# EasyEDA Pro project XWQ_Board1.eprj

# Schematic Schematic1
Create Date: 2023-08-19; Page Name: P1; Project Name: XWQ_Board1; Schematic Name: Schematic1; Update Date: 2023-08-19; Company: 嘉立创EDA; Page Size: A4; Version: V1.0
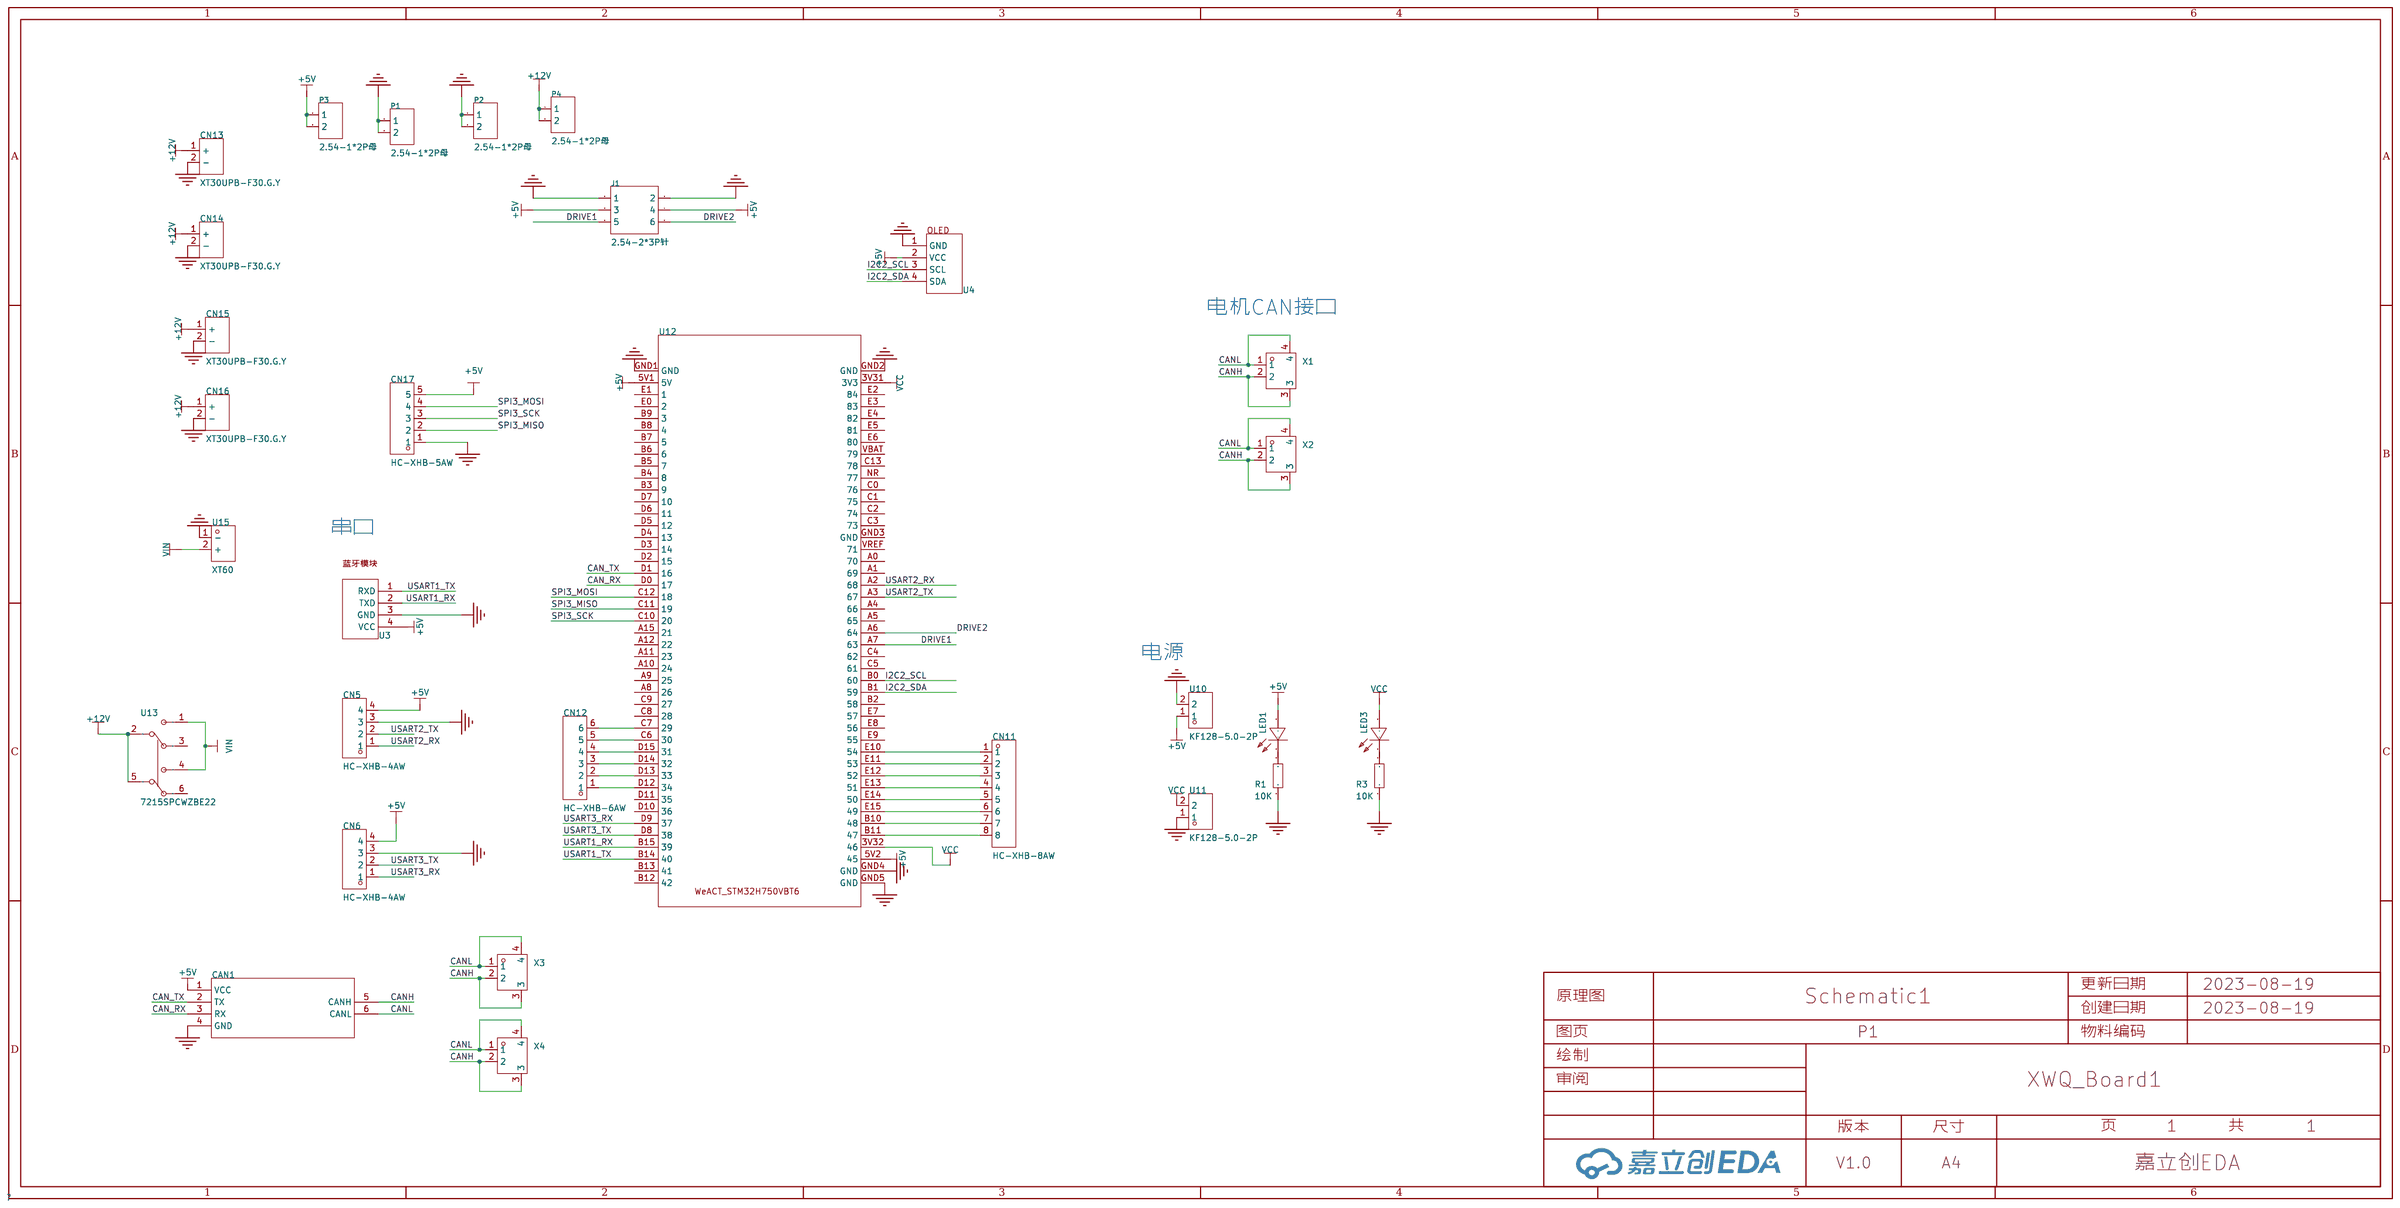
[diagram p0: schematic sheet]

## Parts
CAN1  -  [CAN模块]
CN5  HC-XHB-4AW  [CONN-TH_4P-P2.5_HCTL_HC-XHB-4AW]
CN6  HC-XHB-4AW  [CONN-TH_4P-P2.5_HCTL_HC-XHB-4AW]
CN11  HC-XHB-8AW  [CONN-TH_HC-XHB-8AW]
CN12  HC-XHB-6AW  [CONN-TH_6P-P2.50_HCTL_HC-XHB-6AW]
CN13  XT30UPB-F30.G.Y  [CONN-TH_XT30UPB-F]
CN14  XT30UPB-F30.G.Y  [CONN-TH_XT30UPB-F]
CN15  XT30UPB-F30.G.Y  [CONN-TH_XT30UPB-F]
CN16  XT30UPB-F30.G.Y  [CONN-TH_XT30UPB-F]
CN17  HC-XHB-5AW  [CONN-TH_5P-P2.50_HCTL_HC-XHB-5AW]
J1  2.54-2*3P针  [HDR-TH_6P-P2.54-V-M-R2-C3-S2.54-1]
LED1  NCD0805R1  [LED0805-RD_RED]
LED3  NCD0805R1  [LED0805-RD_RED]
P1  2.54-1*2P母  [HDR-TH_2P-P2.54-V-F]
P2  2.54-1*2P母  [HDR-TH_2P-P2.54-V-F]
P3  2.54-1*2P母  [HDR-TH_2P-P2.54-V-F]
P4  2.54-1*2P母  [HDR-TH_2P-P2.54-V-F]
R1  10K  [R0603]
R3  10K  [R0603]
U3  -  [蓝牙模块]
U4  -  [OLED]
U10  KF128-5.0-2P  [CONN-TH_P5.00_KF128-5.0-2P]
U11  KF128-5.0-2P  [CONN-TH_P5.00_KF128-5.0-2P]
U12  -  [WeAct_STM32H750VBT6核心板]
U13  7215SPCWZBE22  [SW-TH_6P-L12.7-W11.4-P4.70-LS4.8]
U15  XT60  [CONN-TH_XT60]
X1  GH125-S02DCA-00  [CONN-SMD_2P-P1.25_JUSHUO_GH125-S02DCA-00]
X2  GH125-S02DCA-00  [CONN-SMD_2P-P1.25_JUSHUO_GH125-S02DCA-00]
X3  GH125-S02DCA-00  [CONN-SMD_2P-P1.25_JUSHUO_GH125-S02DCA-00]
X4  GH125-S02DCA-00  [CONN-SMD_2P-P1.25_JUSHUO_GH125-S02DCA-00]

## Library data of the parts
CAN1 = CAN模块
CN5 CN6 = HC-XHB-4AW: 参考系列:-;间距:2.5mm;插针结构:1x4P;排数:1;每排PIN数:4;行距:-;公母:公型插针;安装方式:弯插;额定电流:3A;工作温度范围:-25℃~+85℃;; LCSC Part Name: 2.54带锁扣卧式插件 4P 针座连接器线对板/线对线连接器; Supplier Part: C2845507; Manufacturer: HCTL(华灿天禄); Supplier Footprint: 弯插,P=2.5mm; JLCPCB Part Class: Extended Part; Datasheet: https://atta.szlcsc.com/upload/public/pdf/source/20210729/C2845505_EFBF7AEAA36C6A5A1E79F7933436620E.pdf; Supplier: LCSC; Pitch: 2.5mm; Pins Structure: 1x4P; Number of Rows: 1; Number of PINs Per Row: 4; Gender: 公型插针; Mounting Style: 弯插; Current Rating (Max): 3A; Operating Temperature Range: -25℃~+85℃
CN11 = HC-XHB-8AW: 参考系列:-;间距:2.5mm;插针结构:1x8P;排数:1;每排PIN数:8;行距:-;公母:公型插针;安装方式:弯插;额定电流:3A;工作温度范围:-25℃~+85℃;; LCSC Part Name: 2.54带锁扣卧式插件 8P 针座连接器线对板/线对线连接器; Supplier Part: C2845511; Manufacturer: HCTL(华灿天禄); Supplier Footprint: 弯插,P=2.5mm; JLCPCB Part Class: Extended Part; Datasheet: https://atta.szlcsc.com/upload/public/pdf/source/20210729/C2845505_EFBF7AEAA36C6A5A1E79F7933436620E.pdf; Supplier: LCSC; Pitch: 2.5mm; Pins Structure: 1x8P; Number of Rows: 1; Number of PINs Per Row: 8; Gender: 公型插针; Mounting Style: 弯插; Current Rating (Max): 3A; Operating Temperature Range: -25℃~+85℃
CN12 = HC-XHB-6AW: 参考系列:-;间距:2.5mm;插针结构:1x6P;排数:1;每排PIN数:6;行距:-;公母:公型插针;安装方式:弯插;额定电流:3A;工作温度范围:-25℃~+85℃;; LCSC Part Name: 2.54带锁扣卧式插件 6P 针座连接器线对板/线对线连接器; Supplier Part: C2845509; Manufacturer: HCTL(华灿天禄); Supplier Footprint: 弯插,P=2.5mm; JLCPCB Part Class: Extended Part; Datasheet: https://atta.szlcsc.com/upload/public/pdf/source/20210729/C2845505_EFBF7AEAA36C6A5A1E79F7933436620E.pdf; Supplier: LCSC; Pitch: 2.5mm; Pins Structure: 1x6P; Number of Rows: 1; Number of PINs Per Row: 6; Gender: 公型插针; Mounting Style: 弯插; Current Rating (Max): 3A; Operating Temperature Range: -25℃~+85℃
CN13-CN16 = XT30UPB-F30.G.Y: 模型插头连接器; LCSC Part Name: AMASS(艾迈斯)直立焊板式连接器XT30UPB30-F.G.*; Supplier Part: C108769; Manufacturer: AMASS(艾迈斯); JLCPCB Part Class: 扩展库; Datasheet: https://atta.szlcsc.com/upload/public/pdf/source/20220715/AFD68B9E8B6CA95A7295DBF4AF9325E4.pdf; Supplier: LCSC
CN17 = HC-XHB-5AW: 参考系列:-;间距:2.5mm;插针结构:1x5P;排数:1;每排PIN数:5;行距:-;公母:公型插针;安装方式:弯插;额定电流:3A;工作温度范围:-25℃~+85℃;; LCSC Part Name: 2.54带锁扣卧式插件 5P 针座连接器线对板/线对线连接器; Supplier Part: C2845508; Manufacturer: HCTL(华灿天禄); Supplier Footprint: 弯插,P=2.5mm; JLCPCB Part Class: 扩展库; Datasheet: https://atta.szlcsc.com/upload/public/pdf/source/20210729/C2845505_EFBF7AEAA36C6A5A1E79F7933436620E.pdf; Supplier: LCSC; Pitch: 2.5mm; Pins Structure: 1x5P; Number of Rows: 1; Number of PINs Per Row: 5; Gender: 公型插针; Mounting Style: 弯插; Current Rating (Max): 3A; Operating Temperature Range: -25℃~+85℃
J1 = 2.54-2*3P针: 排数:双排;总PIN位数:6P;间距:2.54mm;插针结构:-;行距:-;安装类型:直插;圆针/方针:-;额定电流:-;额定电压:-;配合针长度:-;塑高:-;触头材质:-;触头镀层:-;颜色:黑色;; LCSC Part Name: 2.54mm 直插; Supplier Part: C65114; Manufacturer: BOOMELE(博穆精密); Supplier Footprint: 插件,P=2.54mm; JLCPCB Part Class: 扩展库; Supplier: LCSC; Number of Rows: 双排; Number of Pins: 6P; Pitch: 2.54mm; Mounting Type: 直插; Color: 黑色
LED1 LED3 = NCD0805R1: 发光颜色:红灯;; LCSC Part Name: 红灯; Supplier Part: C84256; Manufacturer: 国星光电; Supplier Footprint: 0805; JLCPCB Part Class: Basic Part; Datasheet: https://atta.szlcsc.com/upload/public/pdf/source/20200820/C84256_F0A75A43B3EAD75808600A0514C76B99.pdf; Supplier: LCSC; Emitted Color: 红灯
P1-P4 = 2.54-1*2P母: 排数:单排;总孔位数:2;间距:2.54mm;插孔结构:1x2P;行距:-;安装类型:直插;塑高:-;触头材质:-;触头镀层:-;; LCSC Part Name: 2.54mm 1x2P; Supplier Part: C49661; Manufacturer: BOOMELE(博穆精密); Supplier Footprint: 直插,P=2.54mm; JLCPCB Part Class: 扩展库; Supplier: LCSC; Number of Rows: 单排; Number of Holes: 2; Pitch: 2.54mm; Holes Structure: 1x2P; Mounting Type: 直插
R1 R3 = Res_0603: Supplier Footprint: 0603
U3 = 蓝牙模块
U4 = OLED
U10 U11 = KF128-5.0-2P: 间距:5mm;排数:1;每排PIN数:2;安装方式:直针;额定电流:24A;额定电压:250V;线规 - AWG:12~22;线规 - mm?:2.5;工作温度范围:-40℃~+105℃;颜色:绿色;; LCSC Part Name: 5mm 排数:1 每排P数:2 直针 可拼接 铜 环保; Supplier Part: C474950; Manufacturer: KEFA(科发); Supplier Footprint: 直插,P=5mm; JLCPCB Part Class: Extended Part; Datasheet: https://atta.szlcsc.com/upload/public/pdf/source/20200115/C474950_DBD958BD409DEFD076718528A2A5023E.pdf; Supplier: LCSC; Pitch: 5mm; Number of Rows: 1; Number of PINs Per Row: 2; Mounting Style: 直针; Current Rating (Max): 24A; Voltage Rating (Max): 250V; Wire Gauge - AWG: 12~22; Wire Gauge - mm?: 2.5; Operating Temperature Range: -40℃~+105℃; Color: 绿色
U12 = STM32H750VBT6
U13 = 7215SPCWZBE22: LCSC Part Name: 钮子开关; Supplier Part: C2895583; Manufacturer: CK; Supplier Footprint: 插件; JLCPCB Part Class: 扩展库; Datasheet: https://atta.szlcsc.com/upload/public/pdf/source/20211231/11C8489155551633DA4BD4318A5AC87F.pdf; Supplier: LCSC
U15 = XT60: 模型锂电连接器 XT60-M; LCSC Part Name: AMASS(艾迈斯) XT60模型插头 3.5mm镀金香蕉头公头（电调端）XT60-M; Supplier Part: C98733; Manufacturer: AMASS(艾迈斯); JLCPCB Part Class: 扩展库; Datasheet: https://atta.szlcsc.com/upload/public/pdf/source/20170606/1496716524919.pdf; Supplier: LCSC
X1-X4 = GH125-S02DCA-00: 参考系列:-;间距:1.25mm;插针结构:1x2P;排数:1;每排PIN数:2;行距:-;公母:公型插针;安装方式:卧贴;额定电流:1A;工作温度范围:-25℃~+85℃;; LCSC Part Name: GH1.25卧式贴片 带扣; Supplier Part: C2886765; Manufacturer: JS(钜硕电子); Supplier Footprint: SMD,P=1.25mm; JLCPCB Part Class: Extended Part; Datasheet: https://atta.szlcsc.com/upload/public/pdf/source/20210818/CD11791E5ED3EDF45A7009E9C8A2BD4C.pdf; Supplier: LCSC; Pitch: 1.25mm; Pins Structure: 1x2P; Number of Rows: 1; Number of PINs Per Row: 2; Gender: 公型插针; Mounting Style: 卧贴; Current Rating (Max): 1A; Operating Temperature Range: -25℃~+85℃

## Nets
+5V: CAN1.1(VCC) CN5.4 CN6.4 CN17.5 J1.3 J1.4 LED1.2(+) P3.1 P3.2 U3.4(VCC) U4.2(VCC) U10.1 U12.5V1(5V) U12.5V2(45)
+12V: CN13.1(+) CN14.1(+) CN15.1(+) CN16.1(+) P4.1 P4.2 U13.2 U13.5
GND: CAN1.4(GND) CN5.3 CN6.3 CN13.2(-) CN14.2(-) CN15.2(-) CN16.2(-) CN17.1 J1.1 J1.2 P1.1 P1.2 P2.1 P2.2 R1.1 R3.1 U3.3(GND) U4.1(GND) U10.2 U11.1 U12.GND1(GND) U12.GND2(GND) U12.GND4(GND) U12.GND5(GND) U15.1(-)
VCC: LED3.2(+) U11.2 U12.3V31(3V3) U12.3V32(46)
VIN: U13.1 U13.4 U15.2(+)
CAN_RX: CAN1.3(RX) U12.D0(17)
CAN_TX: CAN1.2(TX) U12.D1(16)
CANH: CAN1.5(CANH) X1.2 X1.3 X2.2 X2.3 X3.2 X3.3 X4.2 X4.3
CANL: CAN1.6(CANL) X1.1 X1.4 X2.1 X2.4 X3.1 X3.4 X4.1 X4.4
DRIVE1: J1.5 U12.A7(63)
DRIVE2: J1.6 U12.A6(64)
I2C2_SCL: U4.3(SCL) U12.B0(60)
I2C2_SDA: U4.4(SDA) U12.B1(59)
SPI3_MISO: CN17.2 U12.C11(19)
SPI3_MOSI: CN17.4 U12.C12(18)
SPI3_SCK: CN17.3 U12.C10(20)
USART1_RX: U3.2(TXD) U12.B15(39)
USART1_TX: U3.1(RXD) U12.B14(40)
USART2_RX: CN5.1 U12.A2(68)
USART2_TX: CN5.2 U12.A3(67)
USART3_RX: CN6.1 U12.D9(37)
USART3_TX: CN6.2 U12.D8(38)
$1N11723: LED1.1(-) R1.2
$1N25769: LED3.1(-) R3.2
$1N27531: CN11.7 U12.B10(48)
$1N27535: CN11.6 U12.E15(49)
$1N27540: CN11.5 U12.E14(50)
$1N27544: CN11.4 U12.E13(51)
$1N27548: CN11.3 U12.E12(52)
$1N27552: CN11.2 U12.E11(53)
$1N27556: CN11.1 U12.E10(54)
$1N30172: CN12.1 U12.D12(34)
$1N30176: CN12.2 U12.D13(33)
$1N30180: CN12.3 U12.D14(32)
$1N30184: CN12.4 U12.D15(31)
$1N30188: CN12.5 U12.C6(30)
$1N30192: CN12.6 U12.C7(29)
$1N35901: CN11.8 U12.B11(47)

Not connected (* = marked no-connect by the designer): U12 A0(70) A1(69) A4(66) A5(65) A8(26) A9(25) A10(24) A11(23) A12(22) A15(21) B2(58) B3(9) B4(8) B5(7) B6(6) B7(5) B8(4) B9(3) B12(42) B13(41) C0(76) C1(75) C2(74) C3(73) C4(62) C5(61) C8(28) C9(27) C13(78) D2(15) D3(14) D4(13) D5(12) D6(11) D7(10) D10(36) D11(35) E0(2) E1(1) E2(84) E3(83) E4(82) E5(81) E6(80) E7(57) E8(56) E9(55) GND3(GND) NR(77) VBAT(79) VREF(71); U13 3 6

## Notes on the sheet
- 电机CAN接口
- 串口
- 电源

# Board PCB3
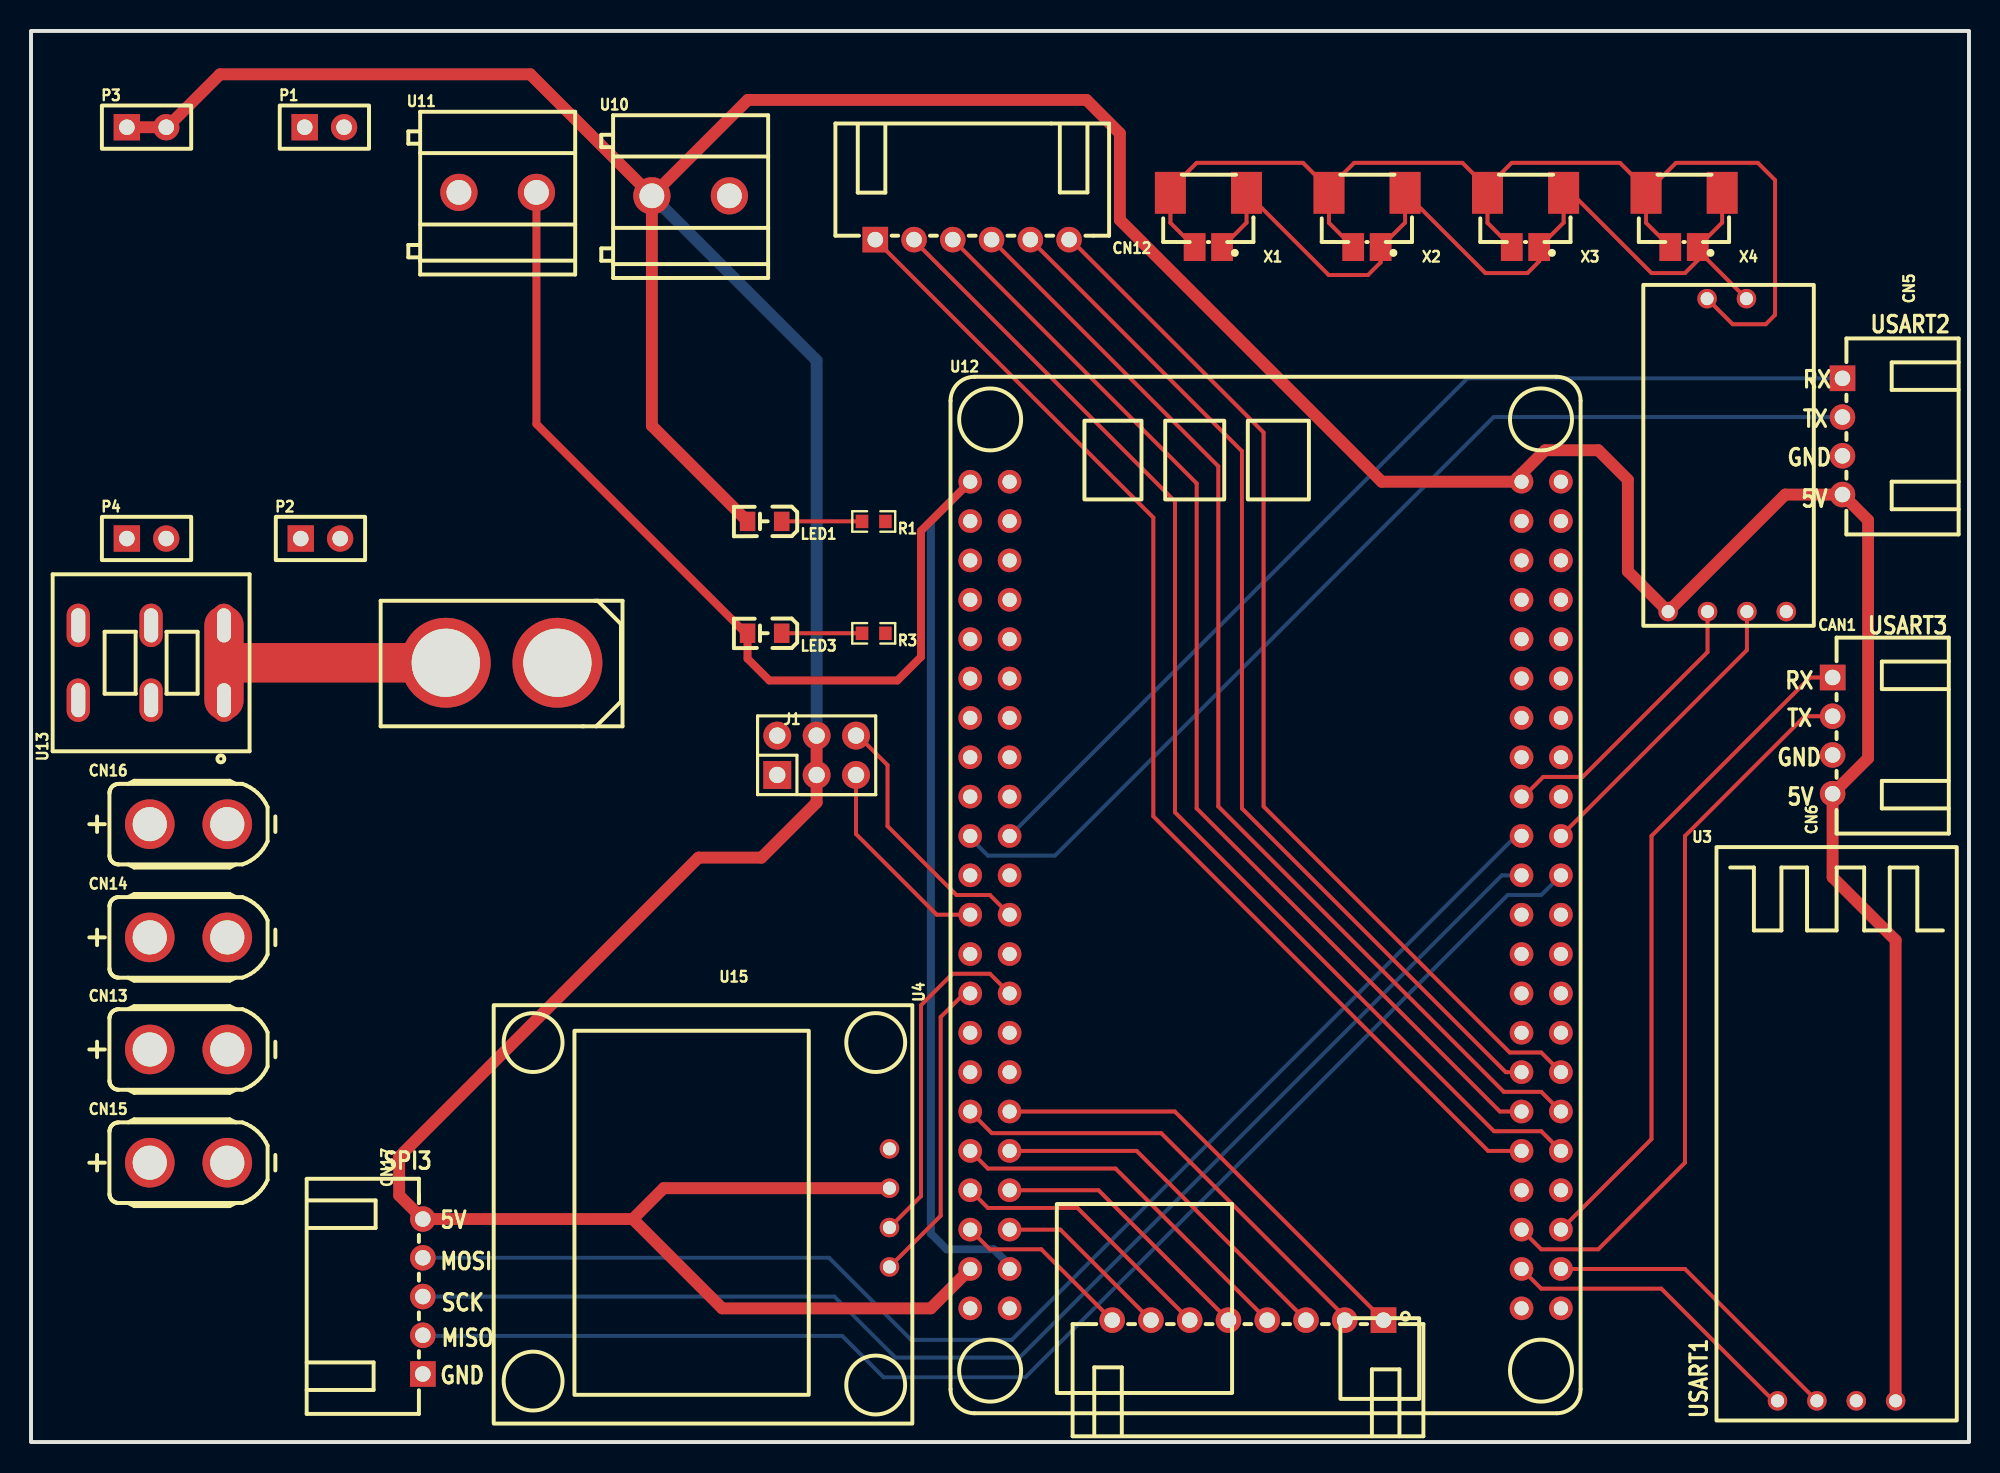
[diagram p1: board, top side]
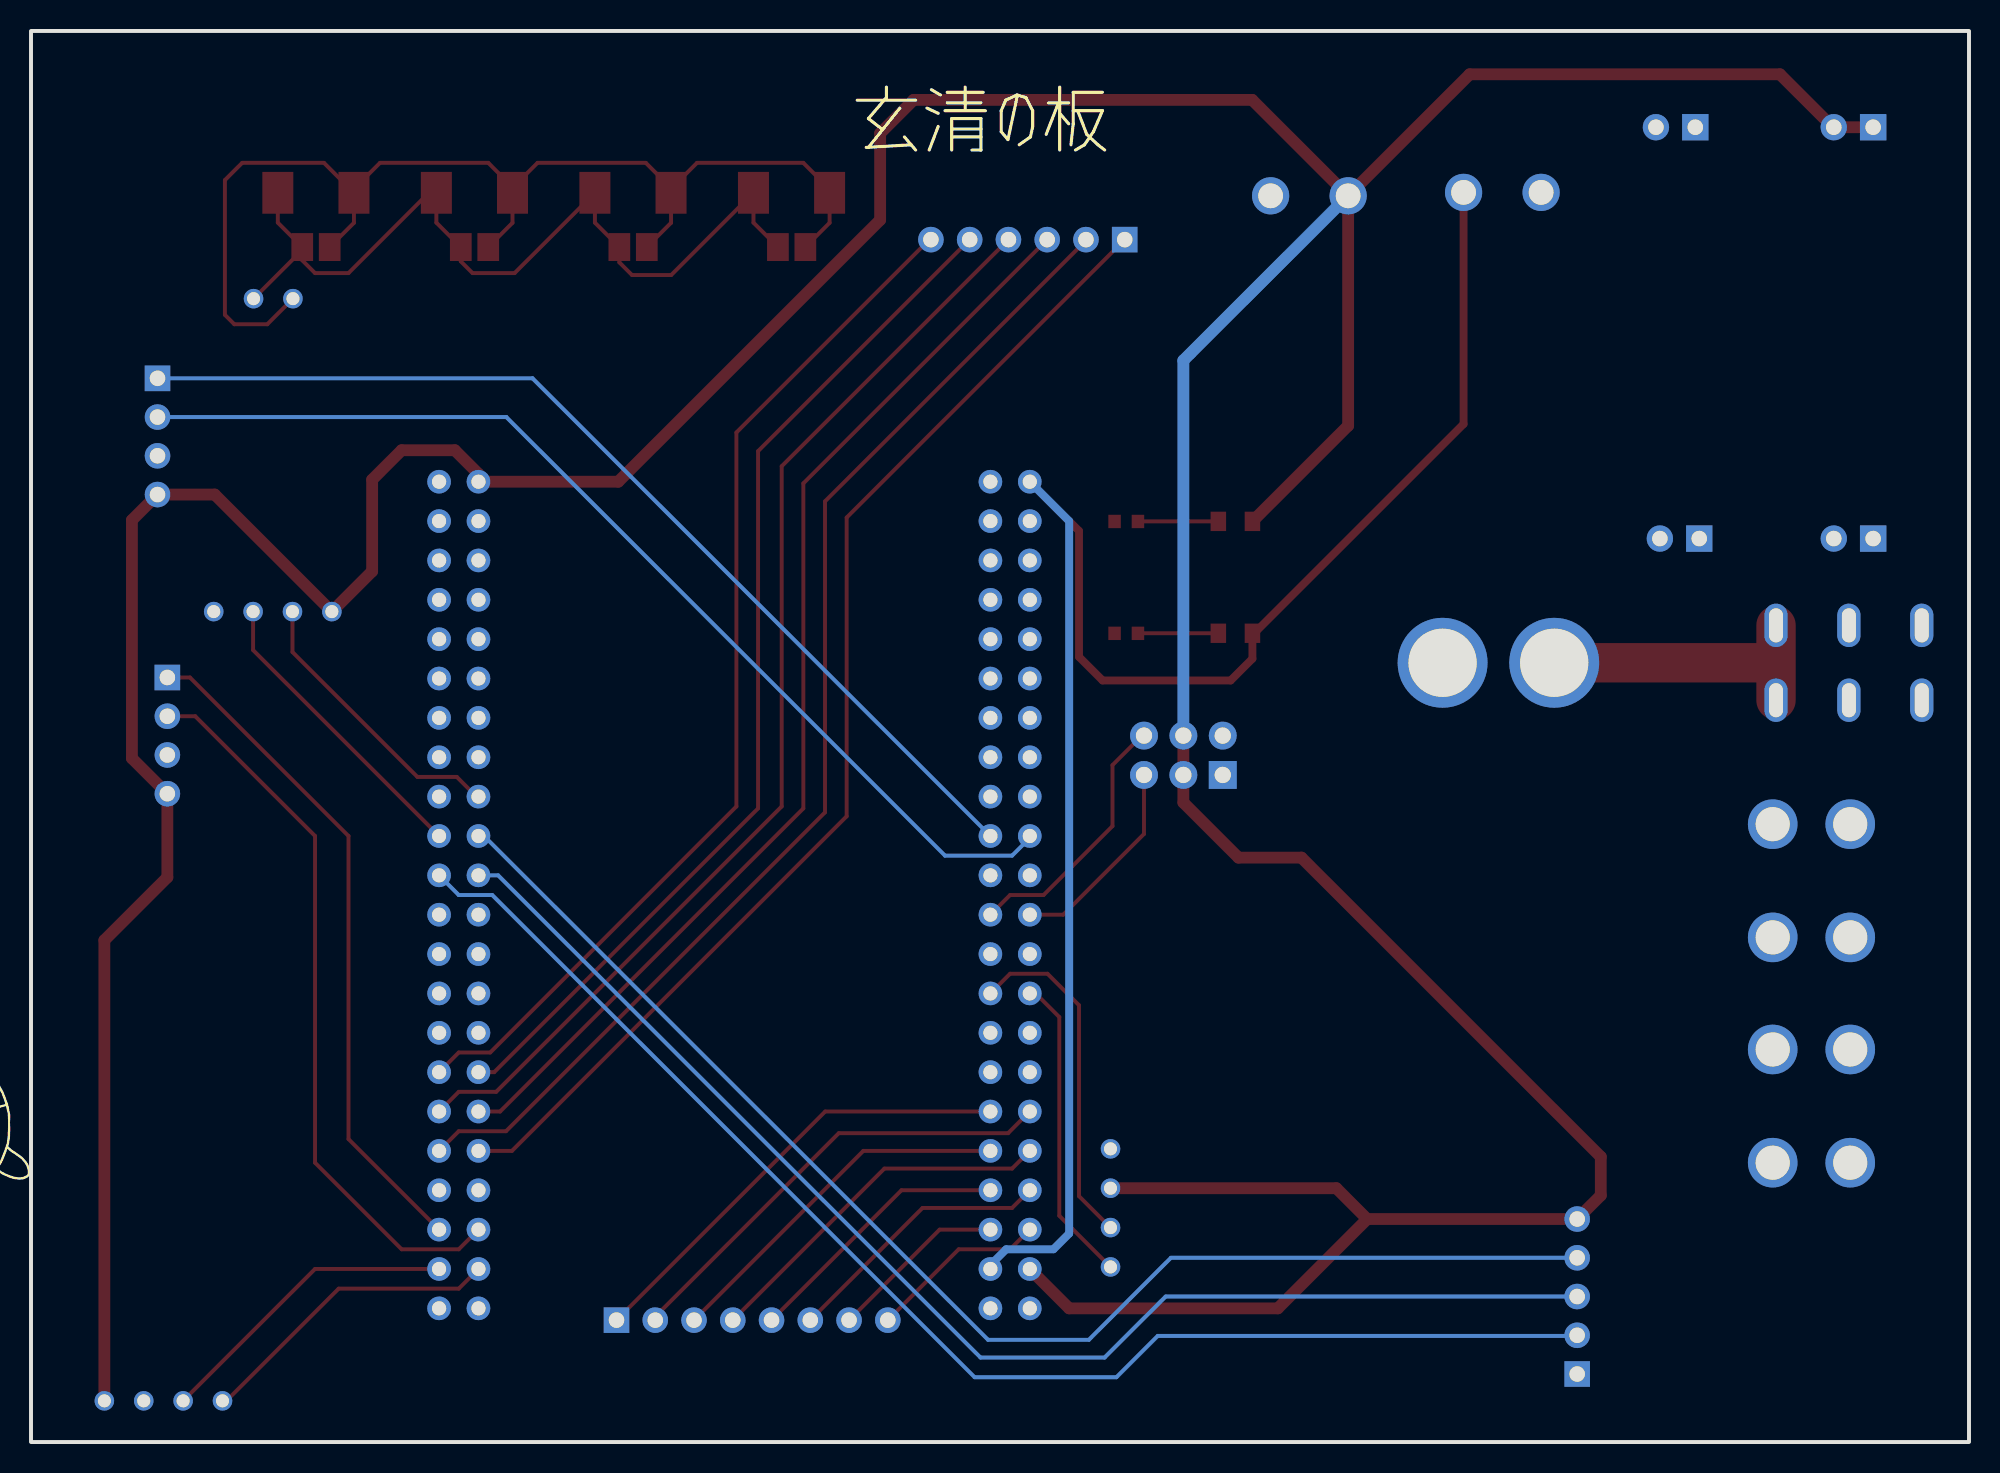
[diagram p2: board, bottom side, seen from below]

Outline 125 x 91.05 mm; copper layers: Top Layer, Bottom Layer. Coordinates in mm from the lower left corner of the outline.
Outline path: rectangle 0,91.05 125,0
Stack: Top Layer 0.035mm / Dielectric1 1.51mm FR4 er 4.5 / Bottom Layer 0.035mm

## Design rules (mm)
template: 自定义配置
spacing copperThickness1oz (default): track to track 0.102, other pairs 0.152 to 0.3
spacing copperThickness2oz: track to track 0.203, other pairs 0.152 to 0.3
track width copperThickness1oz (default): min 0.127, default 0.254, max 2.54
track width copperThickness2oz: min 0.203, default 0.254, max 2.54
differential pair differentialPair (default): width min 0.127, default 0.254, max 2.54; gap min 0.152, default 0.152
via viaSize (default): diameter min 0.5, default 0.61, max 10; hole min 0.3, default 0.305, max 6.299
net +12V uses 12V_Region
net VIN uses 12V_Region
pour e1104 uses 12V_Region

## Placement (name value [footprint] x y rotation side)
CAN1  -  [CAN模块]  114.61 50.92 180 top
CN5  HC-XHB-4AW  [CONN-TH_4P-P2.5_HCTL_HC-XHB-4AW]  116.84 64.89 90 top
CN6  HC-XHB-4AW  [CONN-TH_4P-P2.5_HCTL_HC-XHB-4AW]  116.21 45.58 90 top
CN11  HC-XHB-8AW  [CONN-TH_HC-XHB-8AW]  78.49 7.86 180 top
CN12  HC-XHB-6AW  [CONN-TH_6P-P2.50_HCTL_HC-XHB-6AW]  60.71 77.59 180 top
CN13  XT30UPB-F30.G.Y  [CONN-TH_XT30UPB-F]  10.16 25.33 0 top
CN14  XT30UPB-F30.G.Y  [CONN-TH_XT30UPB-F]  10.16 32.56 0 top
CN15  XT30UPB-F30.G.Y  [CONN-TH_XT30UPB-F]  10.16 18.02 0 top
CN16  XT30UPB-F30.G.Y  [CONN-TH_XT30UPB-F]  10.16 39.87 0 top
CN17  HC-XHB-5AW  [CONN-TH_5P-P2.50_HCTL_HC-XHB-5AW]  25.27 9.39 270 top
J1  2.54-2*3P针  [HDR-TH_6P-P2.54-V-M-R2-C3-S2.54-1]  50.67 44.31 0 top
LED1  NCD0805R1  [LED0805-RD_RED]  47.32 59.4 180 top
LED3  NCD0805R1  [LED0805-RD_RED]  47.32 52.19 180 top
P1  2.54-1*2P母  [HDR-TH_2P-P2.54-V-F]  18.92 84.84 0 top
P2  2.54-1*2P母  [HDR-TH_2P-P2.54-V-F]  18.67 58.3 0 top
P3  2.54-1*2P母  [HDR-TH_2P-P2.54-V-F]  7.45 84.84 0 top
P4  2.54-1*2P母  [HDR-TH_2P-P2.54-V-F]  7.45 58.3 0 top
R1  10K  [R0603]  54.36 59.4 180 top
R3  10K  [R0603]  54.36 52.18 180 top
U3  -  [蓝牙模块]  108.46 1 0 top
U4  -  [OLED]  54.99 18.92 270 top
U10  KF128-5.0-2P  [CONN-TH_P5.00_KF128-5.0-2P]  42.54 80.41 0 top
U11  KF128-5.0-2P  [CONN-TH_P5.00_KF128-5.0-2P]  30.1 80.63 0 top
U12  -  [WeAct_STM32H750VBT6核心板]  79.63 35.29 0 top
U13  7215SPCWZBE22  [SW-TH_6P-L12.7-W11.4-P4.70-LS4.8]  7.75 50.28 90 top
U15  XT60  [CONN-TH_XT60]  30.35 50.28 180 top
X1  GH125-S02DCA-00  [CONN-SMD_2P-P1.25_JUSHUO_GH125-S02DCA-00]  75.95 78.86 180 top
X2  GH125-S02DCA-00  [CONN-SMD_2P-P1.25_JUSHUO_GH125-S02DCA-00]  86.17 78.86 180 top
X3  GH125-S02DCA-00  [CONN-SMD_2P-P1.25_JUSHUO_GH125-S02DCA-00]  96.4 78.86 180 top
X4  GH125-S02DCA-00  [CONN-SMD_2P-P1.25_JUSHUO_GH125-S02DCA-00]  106.63 78.86 180 top

## Footprints (pads in the part's own frame, mm; a bottom-side part is the same pattern mirrored in y, then rotated)
CAN模块
  round 1.26 hole 0.84: 1(9.017,-2.667) 2(6.477,-2.667) 3(3.937,-2.667) 4(1.397,-2.667) 5(6.506,-22.86) 6(3.966,-22.86)
CONN-SMD_2P-P1.25_JUSHUO_GH125-S02DCA-00
  rect 1.4x1.8 smd: 1(-0.879,1.75) 2(0.891,1.75)
  rect 2x2.7 smd: 3(2.455,-1.75) 4(-2.455,-1.75)
CONN-TH_4P-P2.5_HCTL_HC-XHB-4AW
  rect 1.65x1.65 hole 1: 1(3.75,0)
  round 1.65 hole 1: 2(1.25,0) 3(-1.25,0) 4(-3.75,0)
CONN-TH_5P-P2.50_HCTL_HC-XHB-5AW
  rect 1.65x1.65 hole 1: 1(5,0)
  round 1.65 hole 1: 2(2.5,0) 3(0,0) 4(-2.5,0) 5(-5,0)
CONN-TH_6P-P2.50_HCTL_HC-XHB-6AW
  rect 1.65x1.65 hole 1: 1(6.25,0)
  round 1.65 hole 1: 2(3.75,0) 3(1.25,0) 4(-1.25,0) 5(-3.75,0) 6(-6.25,0)
CONN-TH_HC-XHB-8AW
  rect 1.65x1.65 hole 1: 1(-8.75,0)
  round 1.65 hole 1: 2(-6.25,0) 3(-3.75,0) 4(-1.25,0) 5(1.25,0) 6(3.75,0) 7(6.25,0) 8(8.75,0)
CONN-TH_P5.00_KF128-5.0-2P
  round 2.4 hole 1.6: 1(-2.5,0) 2(2.5,0)
CONN-TH_XT30UPB-F
  round 3.2 hole 2.2: 1(-2.5,0) 2(2.5,0)
CONN-TH_XT60
  round 5.8 hole 4.4: 1(-3.6,0) 2(3.6,0)
HDR-TH_2P-P2.54-V-F
  rect 1.7x1.7 hole 1: 1(-1.27,0)
  round 1.7 hole 1: 2(1.27,0)
HDR-TH_6P-P2.54-V-M-R2-C3-S2.54-1
  rect 1.8x1.8 hole 1.05: 1(-2.54,-1.27)
  round 1.8 hole 1.05: 2(-2.54,1.27) 3(0,-1.27) 4(0,1.27) 5(2.54,-1.27) 6(2.54,1.27)
LED0805-RD_RED
  rect 1x1.25 smd: 1(-1.1,0) 2(1.1,0)
OLED
  round 1.26 hole 0.84: 1(0,0.381) 2(2.54,0.381) 3(5.08,0.381) 4(7.62,0.381)
R0603
  rect 0.806x0.864 smd: 1(-0.753,0) 2(0.753,0)
SW-TH_6P-L12.7-W11.4-P4.70-LS4.8
  oval 2.8x1.5 hole 2.2x0.9: 1(-2.415,-4.7) 2(-2.415,0) 3(-2.415,4.7) 4(2.415,-4.7) 5(2.415,0) 6(2.415,4.7)
WeAct_STM32H750VBT6核心板
  round 1.524 hole 0.914: 3V31(-19.05,26.67) 3V32(-16.51,-24.13) 5V1(16.51,26.67) 5V2(-19.05,-24.13) A0(-16.51,6.35) A1(-19.05,6.35) A2(-16.51,3.81) A3(-19.05,3.81) A4(-16.51,1.27) A5(-19.05,1.27) A6(-16.51,-1.27) A7(-19.05,-1.27) A8(16.51,-6.35) A9(19.05,-6.35) A10(16.51,-3.81) A11(19.05,-3.81) A12(16.51,-1.27) A15(19.05,-1.27) B0(-16.51,-6.35) B1(-19.05,-6.35) B2(-16.51,-8.89) B3(19.05,13.97) B4(16.51,16.51) B5(19.05,16.51) B6(16.51,19.05) B7(19.05,19.05) B8(16.51,21.59) B9(19.05,21.59) B10(-16.51,-21.59) B11(-19.05,-21.59) B12(16.51,-26.67) B13(19.05,-26.67) B14(16.51,-24.13) B15(19.05,-24.13) C0(-16.51,13.97) C1(-19.05,13.97) C2(-16.51,11.43) C3(-19.05,11.43) C4(-16.51,-3.81) C5(-19.05,-3.81) C6(16.51,-11.43) C7(19.05,-11.43) C8(16.51,-8.89) C9(19.05,-8.89) C10(16.51,1.27) C11(19.05,1.27) C12(16.51,3.81) C13(-16.51,16.51) D0(19.05,3.81) D1(16.51,6.35) D2(19.05,6.35) D3(16.51,8.89) D4(19.05,8.89) D5(16.51,11.43) D6(19.05,11.43) D7(16.51,13.97) D8(16.51,-21.59) D9(19.05,-21.59) D10(16.51,-19.05) D11(19.05,-19.05) D12(16.51,-16.51) D13(19.05,-16.51) D14(16.51,-13.97) D15(19.05,-13.97) E0(16.51,24.13) E1(19.05,24.13) E2(-16.51,24.13) E3(-19.05,24.13) E4(-16.51,21.59) E5(-19.05,21.59) E6(-16.51,19.05) E7(-19.05,-8.89) E8(-16.51,-11.43) E9(-19.05,-11.43) E10(-16.51,-13.97) E11(-19.05,-13.97) E12(-16.51,-16.51) E13(-19.05,-16.51) E14(-16.51,-19.05) E15(-19.05,-19.05) GND1(19.05,26.67) GND2(-16.51,26.67) GND3(-16.51,8.89) GND4(-19.05,-26.67) GND5(-16.51,-26.67) NR(-19.05,16.51) VBAT(-19.05,19.05) VREF(-19.05,8.89)
蓝牙模块
  round 1.26 hole 0.84: 1(4.191,1.651) 2(6.731,1.651) 3(9.271,1.651) 4(11.811,1.651)

## Nets
As in the schematic.

Pads without a net: U12 A0 A1 A4 A5 A8 A9 A10 A11 A12 A15 B2 B3 B4 B5 B6 B7 B8 B9 B12 B13 C0 C1 C2 C3 C4 C5 C8 C9 C13 D2 D3 D4 D5 D6 D7 D10 D11 E0 E1 E2 E3 E4 E5 E6 E7 E8 E9 GND3 NR VBAT VREF; U13 3 6

## Routing (per net, layer and track width the routed paths; a pad name or vN(x,y) marks a point on that pad's centre or on a via; arc(x,y) is an arc through that point)
+5V: length 369.5
  Top Layer w0.762: U10.1 40.04,65.58 LED1.2 ; U10.1 46.23,86.6 68.07,86.6 70.23,84.44 70.23,78.86 87.12,61.96 96.14,61.96 96.14,62.47 97.66,64 101.09,64 103,62.09 103,56.18 CAN1.1 113.15,61.14 CN5.4 118.49,59.48 118.49,44.12 CN6.4 116.21,36.44 120.27,32.37 U3.4 ; U10.1 32.2,88.25 12.19,88.25 8.78,84.84 P3.2 P3.1 ; 60.58,11.16 58.04,8.62 44.58,8.62 38.81,14.39 ; 55.37,16.38 40.81,16.38 38.81,14.39 ; J1.4 J1.3 50.67,41.26 47.12,37.71 43.05,37.71 23.75,18.4 23.75,15.91 CN17.5 38.81,14.39
  Bottom Layer w0.762: J1.4 50.67,69.79 U10.1
VCC: length 116.6
  Top Layer w0.508: U11.2 32.6,65.69 46.1,52.19 LED3.2 46.22,50.54 47.62,49.14 55.88,49.14 57.4,50.66 57.4,58.79 60.58,61.96
  Bottom Layer w0.508: 60.58,61.96 58.04,59.42 58.04,13.45 59.06,12.44 62.1,12.44 63.12,11.42 U12.3V32
VIN: length 19
  Top Layer w2.54: 26.5,50.53 U15.2 12.95,50.28 ; U13.4 U13.1
CAN_RX: length 19.4
  Top Layer w0.254: U12.D0 110.68,51.1 CAN1.3
CAN_TX: length 18.5
  Top Layer w0.254: 96.14,41.64 96.27,41.64 97.54,42.91 100.08,42.91 108.14,50.97 CAN1.2
CANH: length 76.1
  Top Layer w0.254: 93.94,80.92 93.94,80.98 95.5,82.54 102.49,82.54 104.17,80.86 X4.3 ; 93.94,80.92 92.33,82.54 85.34,82.54 83.72,80.91 83.72,80.86 ; 93.94,80.92 X3.3 93.94,78.67 X3.2 ; X2.2 83.72,78.67 X2.3 83.72,80.86 ; X4.2 104.17,78.67 X4.3 ; CAN1.5 109.76,72.12 111.89,72.12 112.49,72.73 112.49,81.42 111.38,82.54 106.1,82.54 X4.3 ; 83.72,80.86 82.04,82.54 75.18,82.54 73.49,80.85 X1.3 73.49,78.67 X1.2
CANL: length 57.3
  Top Layer w0.254: 107.5,76.92 107.5,76.25 106.68,75.43 104.52,75.43 99.34,80.61 X3.4 98.85,78.68 X3.1 97.28,76.18 96.52,75.43 93.81,75.43 X2.4 88.63,78.68 X2.1 87.05,76.12 86.23,75.3 83.71,75.3 X1.4 78.4,78.68 X1.1 ; 107.5,76.92 X4.1 109.08,78.68 X4.4 ; 107.5,76.92 CAN1.6
DRIVE1: length 13.3
  Top Layer w0.254: J1.5 53.21,39.23 58.42,34.02 60.58,34.02
DRIVE2: length 17
  Top Layer w0.254: J1.6 53.34,45.58 55.25,43.68 55.25,39.74 59.69,35.29 61.85,35.29 U12.A6
I2C2_SCL: length 22.3
  Top Layer w0.254: U12.B0 61.85,30.21 59.44,30.21 57.4,28.18 57.4,15.86 55.38,13.84 U4.3
I2C2_SDA: length 20
  Top Layer w0.254: 60.58,28.94 60.2,28.94 58.67,27.42 58.67,14.6 U4.4
SPI3_MISO: length 87.9
  Bottom Layer w0.254: U12.C11 97.41,35.29 95.25,35.29 64.13,4.18 54.99,4.18 52.32,6.85 25.31,6.85 CN17.2
SPI3_MOSI: length 86.5
  Bottom Layer w0.254: 96.14,39.1 95.78,39.1 63.27,6.59 56.77,6.59 51.47,11.89 CN17.4
SPI3_SCK: length 85.4
  Bottom Layer w0.254: CN17.3 51.82,9.39 55.75,5.45 63.75,5.45 94.87,36.56 96.14,36.56
USART1_RX: length 20
  Top Layer w0.254: U3.2 106.68,11.16 U12.B15
USART1_TX: length 20
  Top Layer w0.254: 96.14,11.16 97.41,9.89 105.16,9.89 112.4,2.66 U3.1
USART2_RX: length 66
  Bottom Layer w0.254: U12.A2 92.65,68.64 CN5.1
USART2_TX: length 68.6
  Bottom Layer w0.254: 60.58,39.1 60.58,38.98 61.72,37.83 66.04,37.83 94.34,66.14 CN5.2
USART3_RX: length 43.7
  Top Layer w0.254: CN6.1 114.75,49.33 104.52,39.1 104.52,19.55 U12.D9
USART3_TX: length 47.2
  Top Layer w0.254: 96.14,13.7 97.41,12.44 101.09,12.44 106.68,18.02 106.68,39.1 114.41,46.83 CN6.2
$1N11723: length 5.2
  Top Layer w0.254: LED1.1 53.6,59.4 R1.2
$1N25769: length 5.2
  Top Layer w0.254: LED3.1 53.6,52.19 R3.2
$1N27531: length 11.5
  Top Layer w0.254: CN11.7 66.39,13.7 U12.B10
$1N27535: length 17.6
  Top Layer w0.254: CN11.6 67.5,15.1 61.72,15.1 60.58,16.24
$1N27540: length 17.6
  Top Layer w0.254: U12.E14 68.85,16.24 CN11.5
$1N27544: length 23.7
  Top Layer w0.254: CN11.4 69.96,17.64 61.72,17.64 60.58,18.78
$1N27548: length 23.6
  Top Layer w0.254: U12.E12 71.31,18.78 CN11.3
$1N27552: length 29.9
  Top Layer w0.254: CN11.2 84.74,8.09 72.9,19.93 61.98,19.93 60.58,21.32
$1N27556: length 29.7
  Top Layer w0.254: U12.E10 73.77,21.32 CN11.1
$1N30172: length 77.3
  Top Layer w0.254: 96.14,18.78 93.98,18.78 72.39,40.37 72.39,59.65 CN12.1
$1N30176: length 77.9
  Top Layer w0.254: U12.D13 97.41,20.05 94.36,20.05 73.79,40.63 73.79,60.69 56.96,77.53 CN12.2
$1N30180: length 72.3
  Top Layer w0.254: CN12.3 75.18,61.86 75.18,40.88 94.74,21.32 96.14,21.32
$1N30184: length 72.9
  Top Layer w0.254: CN12.4 76.58,62.96 76.58,41.01 95,22.59 97.41,22.59 U12.D15
$1N30188: length 67.4
  Top Layer w0.254: CN12.5 78.1,63.94 78.1,40.88 95.12,23.86 96.14,23.86
$1N30192: length 68.1
  Top Layer w0.254: U12.C7 97.41,25.13 95.38,25.13 79.5,41.01 79.5,65.14 67.06,77.59 CN12.6
$1N35901: length 11.6
  Top Layer w0.254: 60.58,13.7 61.85,12.44 65.16,12.44 CN11.8

## Copper pours and planes (outline as drawn; the poured copper is in the pictures)
+12V on Top Layer: 4.66,60.06 10.16,60.06 10.16,15.73 4.66,15.73
GND on Top Layer: 10.43,91.05 125,91.05 125,0 10.43,0
GND on Bottom Layer: 0,91.05 125,91.05 125,0 0,0

## Text on the board
Bottom Silkscreen Layer: 玄清の板
Top Silkscreen Layer: SPI3 | 5V | GND | MOSI | SCK | MISO | RX | TX | USART3 | USART2 | USART1
